# EAGLE design clock (EAGLE 5.11)
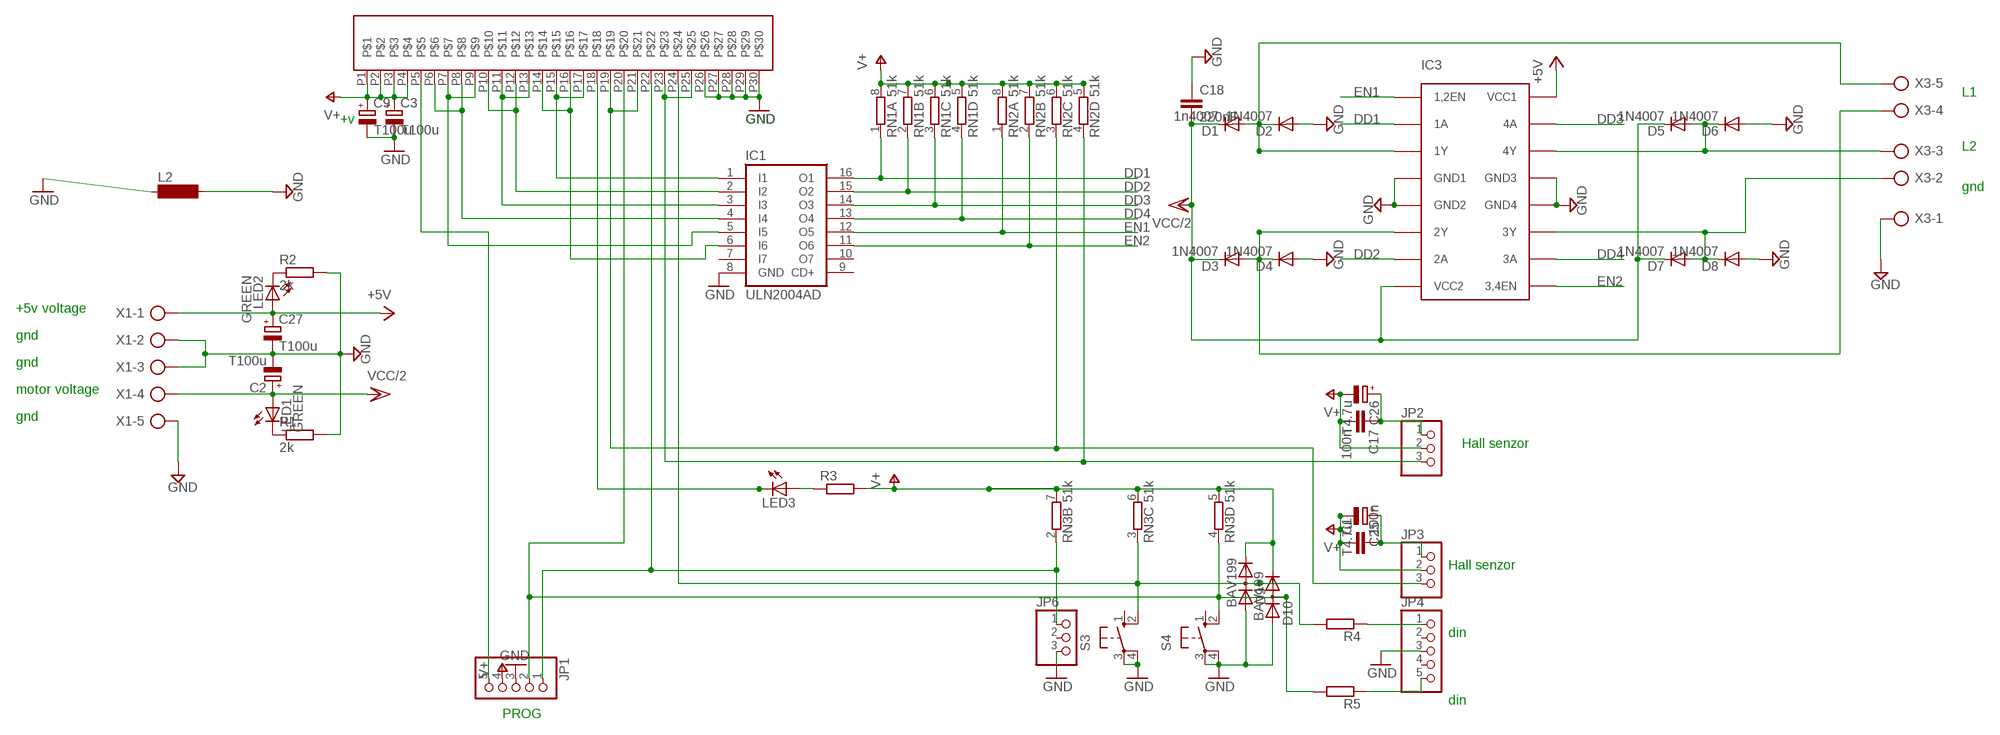
[diagram p0: schematic, sheet 1]

## Parts
C1  100n  C-EUC0603  [C0603]
C2  T100u  CPOL-EUE7.5-18  [E7,5-18]
C3  T100u  CPOL-EUSMCC  [SMC_C]
C9  T100u  CPOL-EUSMCC  [SMC_C]
C17  100n  C-EUC0603  [C0603]
C18  220nF  C-EUC0603  [C0603]
C25  T4.7u  CPOL-EUSMCA  [SMC_A]
C26  T4.7u  CPOL-EUSMCA  [SMC_A]
C27  T100u  CPOL-EUSMCD  [SMC_D]
D1  1n4007  DIODE-DO214AA  [DO214AA]
D2  1N4007  DIODE-DO214AA  [DO214AA]
D3  1N4007  DIODE-DO214AA  [DO214AA]
D4  1N4007  DIODE-DO214AA  [DO214AA]
D5  1N4007  DIODE-DO214AA  [DO214AA]
D6  1N4007  DIODE-DO214AA  [DO214AA]
D7  1N4007  DIODE-DO214AA  [DO214AA]
D8  1N4007  DIODE-DO214AA  [DO214AA]
D9  BAV199  [SOT23]
D10  BAV199  [SOT23]
IC1  ULN2004AD  [SO16]
IC3  L293D  [DIL16]
JP1  PINHD-1X5  [1X05]
JP2  PINHD-1X3  [1X03]
JP3  PINHD-1X3  [1X03]
JP4  PINHD-1X5  [1X05]
JP6  PINHD-1X3  [1X03]
L2  MS85  [MS85]
LED1  GREEN  LEDSMT1206  [1206]
LED2  GREEN  LEDSMT1206  [1206]
LED3  LEDSMT1206  [1206]
R1  2k  R-EU_M0805  [M0805]
R2  2k  R-EU_M0805  [M0805]
R3  R-EU_M0805  [M0805]
R4  R-EU_M0805  [M0805]
R5  R-EU_M0805  [M0805]
RN1  51k  4R-N0603-ARC  [0603-ARC]
RN2  51k  4R-N0603-ARC  [0603-ARC]
RN3  51k  4R-N0603-ARC  [0603-ARC]
S3  40-XX  [B3F-40XX]
S4  40-XX  [B3F-40XX]
U$2  BR5-01132-30XF  FCN-BR-30ZASTRCKA  [FCN-BR5-30]
X1  AK500/5  [AK500/5]
X3  AK500/5  [AK500/5]

## Nets
+5V: C27.+ IC3.16(VCC1) LED2.A X1.1
DD1: IC1.16(O1) IC3.2(1A) RN1.1
DD2: IC1.15(O2) IC3.7(2A) RN1.2
DD3: IC1.14(O3) IC3.15(4A) RN1.3
DD4: IC1.13(O4) IC3.10(3A) RN1.4
DD5: D10.3(AC) JP1.2 R5.2 RN3.4 S4.2(S1) U$2.P20
DD6: D9.3(AC) R4.2 RN3.3 S3.2(S1) U$2.P24
DD7: JP3.3 RN2.3 U$2.P19 U$2.P21
EN1: IC1.12(O5) IC3.1(1,2EN) RN2.1
EN2: IC1.11(O6) IC3.9(3,4EN) RN2.2
GND: C3.- C9.- D9.1(A) D10.1(A) IC1.8(GND) JP1.3 JP4.3 JP6.3 L2.1 S3.3(P) S3.4(P1) S4.3(P) S4.4(P1) U$2.P26 U$2.P27 U$2.P28 U$2.P29 U$2.P30
GND2: C2.- C18.1 C27.- D2.A D4.A D6.A D8.A IC3.4(GND1) IC3.5(GND2) IC3.12(GND4) IC3.13(GND3) L2.2 R1.2 R2.2 X1.2 X1.3 X1.5 X3.1 ; supply symbol labelled GND
GSM_POWERMON: IC1.1(I1) U$2.P15 U$2.P17
GSM_RTS: IC1.2(I2) U$2.P10 U$2.P12
GSM_RX: IC1.3(I3) U$2.P11 U$2.P13
GSM_TX: IC1.4(I4) U$2.P6 U$2.P8
N$1: IC1.6(I6) U$2.P14 U$2.P16
N$2: LED3.A R3.1
N$3: JP1.5 U$2.P5
N$4: JP4.5 R5.1
N$5: D1.A D2.C IC3.3(1Y) X3.5
N$7: IC1.5(I5) U$2.P7 U$2.P9
N$8: D3.A D4.C IC3.6(2Y) X3.4
N$9: D5.A D6.C IC3.14(4Y) X3.3
N$10: D7.A D8.C IC3.11(3Y) X3.2
N$11: JP1.1 JP6.1 RN3.2 U$2.P22
N$12: LED3.C U$2.P18
N$13: JP2.3 RN2.4 U$2.P23 U$2.P25
N$14: LED1.C R1.1
N$15: LED2.C R2.1
N$16: C17.1 C26.+ JP2.1
N$18: JP4.1 R4.1
N$20: C1.2 C25.+ JP3.1
V+: C1.1 C3.+ C9.+ C17.2 C25.- C26.- D9.2(C) D10.2(C) JP1.4 JP2.2 JP3.2 R3.2 RN1.5 RN1.6 RN1.7 RN1.8 RN2.5 RN2.6 RN2.7 RN2.8 RN3.5 RN3.6 RN3.7 U$2.P1 U$2.P2 U$2.P3 U$2.P4
VCC/2: C2.+ C18.2 D1.C D3.C D5.C D7.C IC3.8(VCC2) LED1.A X1.4
Unconnected: IC1.7(I7) IC1.9(CD+) IC1.10(O7) JP4.2 JP4.4 JP6.2 RN3.1 RN3.8 S3.1(S) S4.1(S)

## Notes on the sheet
- L1
- +v | GND
- L2
- gnd
- +5v voltage
- gnd
- gnd
- motor voltage
- gnd
- Hall senzor
- Hall senzor
- din
- din
- PROG

## Library data of the parts
C1 C17 C18 = rcl:C-EU: CAPACITOR, European symbol
C2 C3 C9 C25-C27 = rcl:CPOL-EU: POLARIZED CAPACITOR, European symbol
D1-D8 = diode:DIODE-: DIODE
D9 D10 = diode:BAV199: DIODE low-leakage double diode
IC1 = uln-udn:ULN2004A: DRIVER ARRAY
IC3 = sgs-thom:L293D
JP1 JP4 = pinhead:PINHD-1X5: PIN HEADER
JP2 JP3 JP6 = pinhead:PINHD-1X3: PIN HEADER
L2 = inductor-neosid:MS85: INDUCTOR SMD power inductor; OC_FARNELL: unknown; OC_NEWARK: unknown
LED1-LED3 = led:LED: LED OSRAM: - CHIPLED LG R971, LG N971, LY N971, LG Q971, LY Q971, LO R971, LY R971 LH N974, LH R974 LS Q976, LO Q976, LY Q976 LO Q996 - Hyper CHIPLED LW Q18S LB Q993, LB Q99A, LB R99A - SideLED LS A670, LO A670, LY A670, LG A670, LP A670 LB A673, LV A673, LT A673, LW A673 LH A674 LY A675 LS A676, LA A676, LO A676, LY A676, LW A676 LS A679, LY A679, LG A679 - Hyper Micro SIDELED® LS Y876, LA Y876, LO Y876, LY Y876 LT Y87S - SmartLED LW L88C, LW L88S LB L89C, LB L89S, LG L890 LS L89K, LO L89K, LY L89K LS L896, LA L896, LO L896, LY L896 - TOPLED LS T670, LO T670, LY T670, LG T670, LP T670 LSG T670, LSP T670, LSY T670, LOP T670, LYG T670 LG T671, LOG T671, LSG T671 LB T673, LV T673, LT T673, LW T673 LH T674 LS T676, LA T676, LO T676, LY T676, LB T676, LH T676, LSB T676, LW T676 LB T67C, LV T67C, LT T67C, LS T67K, LO T67K, LY T67K, LW E67C LS E67B, LA E67B, LO E67B, LY E67B, LB E67C, LV E67C, LT E67C LW T67C LS T679, LY T679, LG T679 LS T770, LO T770, LY T770, LG T770, LP T770 LB T773, LV T773, LT T773, LW T773 LH T774 LS E675, LA E675, LY E675, LS T675 LS T776, LA T776, LO T776, LY T776, LB T776 LHGB T686 LT T68C, LB T68C - Hyper Mini TOPLED® LB M676 - Mini TOPLED Santana® LG M470 LS M47K, LO M47K, LY M47K Source: http://www.osram.convergy.de LUXEON: - LUMILED® LXK2-PW12-R00, LXK2-PW12-S00, LXK2-PW14-U00, LXK2-PW14-V00 LXK2-PM12-R00, LXK2-PM12-S00, LXK2-PM14-U00 LXK2-PE12-Q00, LXK2-PE12-R00, LXK2-PE12-S00, LXK2-PE14-T00, LXK2-PE14-U00 LXK2-PB12-K00, LXK2-PB12-L00, LXK2-PB12-M00, LXK2-PB14-N00, LXK2-PB14-P00, LXK2-PB14-Q00 LXK2-PR12-L00, LXK2-PR12-M00, LXK2-PR14-Q00, LXK2-PR14-R00 LXK2-PD12-Q00, LXK2-PD12-R00, LXK2-PD12-S00 LXK2-PH12-R00, LXK2-PH12-S00 LXK2-PL12-P00, LXK2-PL12-Q00, LXK2-PL12-R00 Source: www.luxeon.com KINGBRIGHT: KA-3528ASYC Source: www.kingbright.com
R1-R5 = rcl:R-EU_: RESISTOR, European symbol
RN1-RN3 = resistor-dil:4R-N: Array Chip Resistor Source: RS Component / Phycomp; OC_FARNELL: unknown; OC_NEWARK: unknown
S3 S4 = switch-omron:40-XX: OMRON SWITCH; MF: OMRON COMPONENTS USA; MPN: B3F-4000; OC_FARNELL: 176434; OC_NEWARK: 36K3105
U$2 = MYLIB:FCN-BR-30
X1 X3 = con-ptr500:AK500/5: CONNECTOR; OC_FARNELL: unknown; OC_NEWARK: unknown

## Net classes
0 default: clearance 0.22 mm

## Board
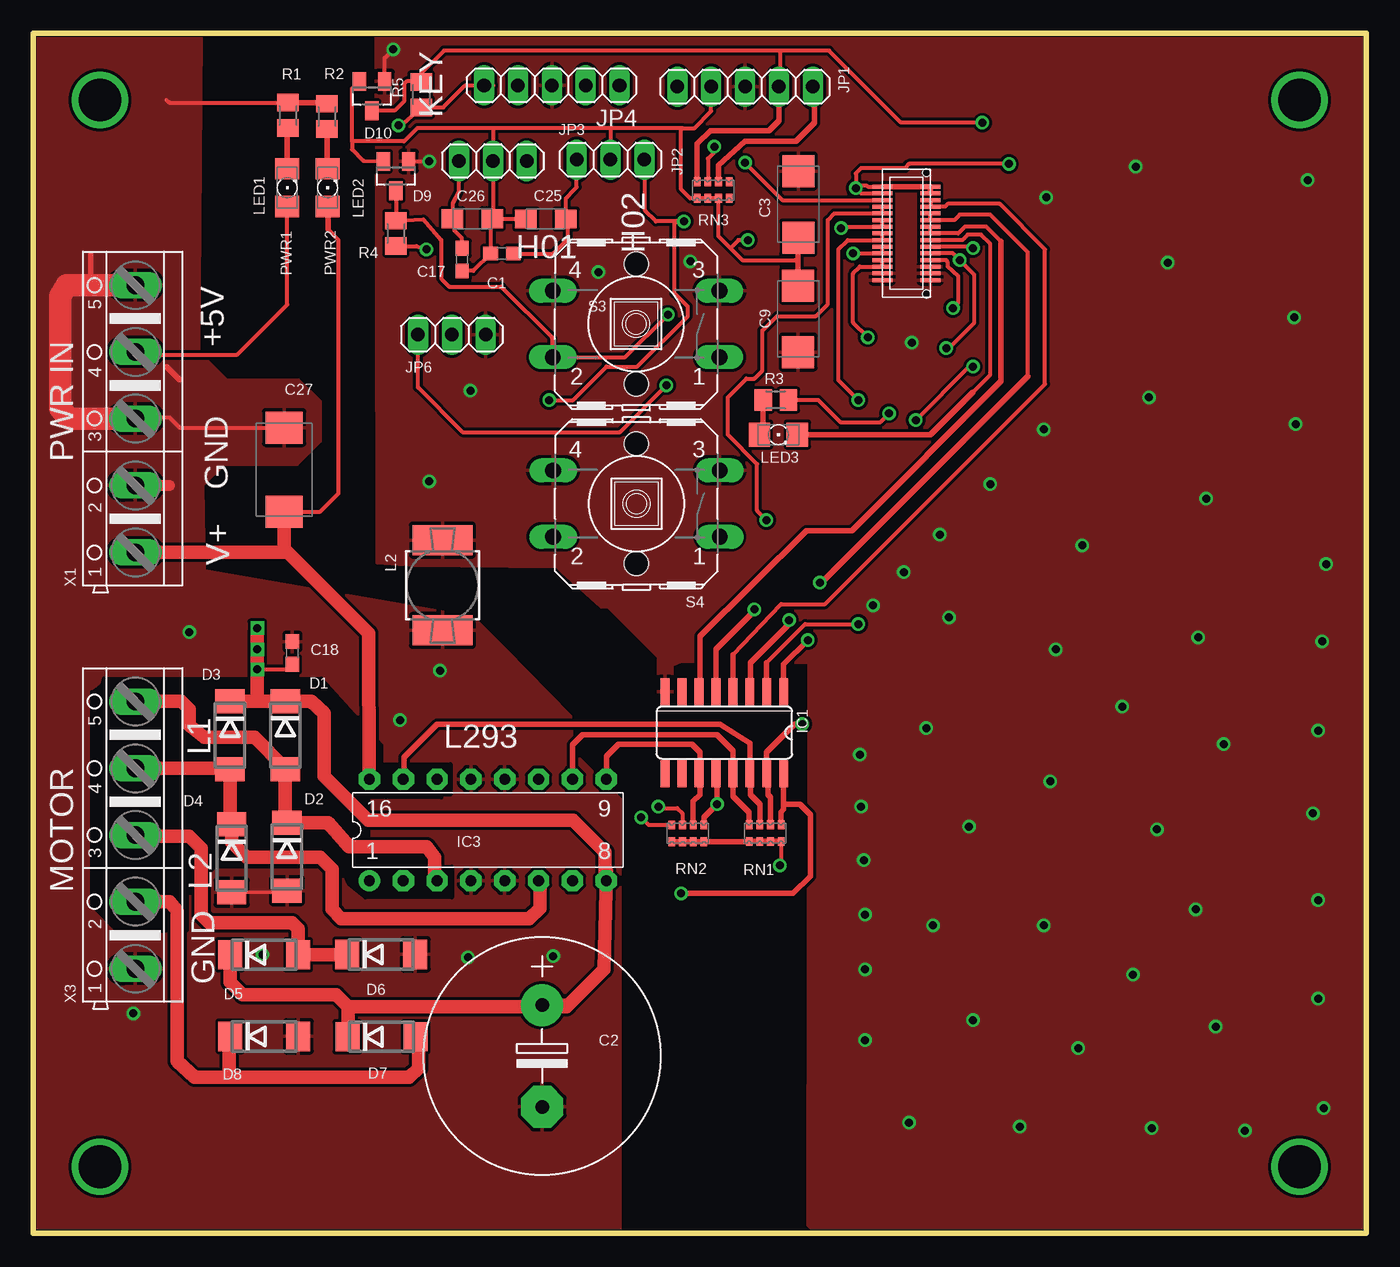
[diagram p1: board, top side]
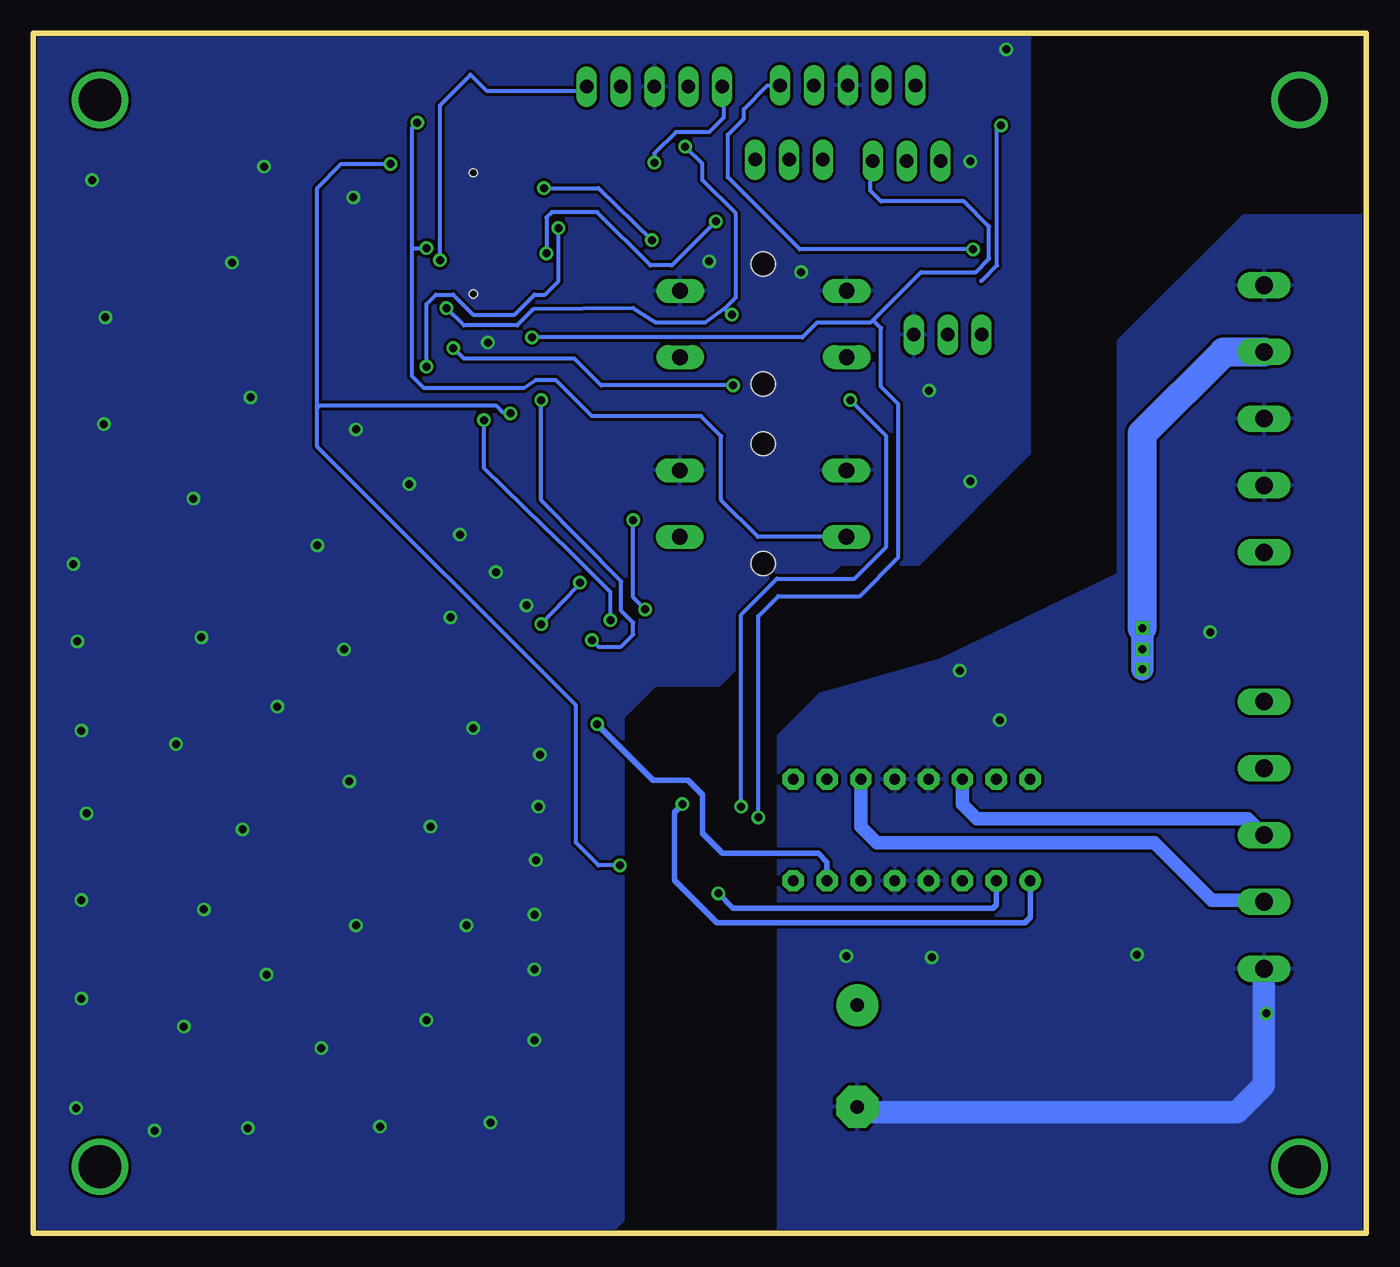
[diagram p2: board, bottom side, seen from below]

Size 100 x 90 mm. Coordinates in mm from the lower left corner, seen from the top.
Outline: 0,90 100,90 100,0 0,0 0,90
Copper layers (1*16): Top 0.018mm / dielectric 1.5mm / Bottom 0.018mm
Design rules "default": minimum track width 6mil, minimum drill 6mil, track to track 5mil, track to pad 5mil, pad to pad 5mil, via to via 5mil, smd to smd 5mil, copper to edge 2mil, drill to drill 8mil, minimum pad ring 10mil, minimum via ring 8mil, stop-mask expansion 4mil, vias tented up to drill 25mil, thermal gap 10mil
tRestrict: area 4.4,22.6 to 31.4,41.6

### Footprints (pad centres in the part's own frame; a part is rotated, then mirrored left to right if it is on the bottom)
C0603 = smd 1.1 x 1: 1 -0.85,0; 2 0.85,0
E7,5-18 = drill 1.016 pad 3.15 round: + -3.81,0 | drill 1.016 pad 3.15 octagon: - 3.81,0
SMC_C = smd 2.4 x 2.4: + -2.5,0; - 2.5,0
SMC_A = smd 1.6 x 1.4: + -1.5,0; - 1.5,0
SMC_D = smd 2.4 x 2.8: + -3.15,0; - 3.15,0
DO214AA = smd 1.8 x 2.2: A 2.55,0; C -2.55,0
SOT23 = smd 1 x 1.4: 1 -0.95,-1.1; 2 0.95,-1.1; 3 0,1.1
SO16 = smd 0.66 x 2.032: 1 -4.445,-3.073; 2 -3.175,-3.073; 3 -1.905,-3.073; 4 -0.635,-3.073; 5 0.635,-3.073; 6 1.905,-3.073; 7 3.175,-3.073; 8 4.445,-3.073; 9 4.445,3.073; 10 3.175,3.073; 11 1.905,3.073; 12 0.635,3.073; 13 -0.635,3.073; 14 -1.905,3.073; 15 -3.175,3.073; 16 -4.445,3.073
DIL16 = drill 0.813 pad 1.6 round: 1 -8.89,-3.81 | drill 0.813 pad 1.6 octagon: 2 -6.35,-3.81; 3 -3.81,-3.81; 4 -1.27,-3.81; 5 1.27,-3.81; 6 3.81,-3.81; 7 6.35,-3.81; 8 8.89,-3.81; 9 8.89,3.81; 10 6.35,3.81; 11 3.81,3.81; 12 1.27,3.81; 13 -1.27,3.81; 14 -3.81,3.81; 15 -6.35,3.81; 16 -8.89,3.81
1X05 = drill 1.016 long: 1 -5.08,0; 2 -2.54,0; 3 0,0; 4 2.54,0; 5 5.08,0
1X03 = drill 1.016 long: 1 -2.54,0; 2 0,0; 3 2.54,0
MS85 = smd 4.5 x 2.25: 1 0,-3.383; 2 0,3.383
1206 = smd 1.6 x 1.803: A -1.422,0; C 1.422,0
M0805 = smd 1.3 x 1.6: 1 -0.95,0; 2 0.95,0
0603-ARC = smd 0.5 x 0.65: 1 -1.2,-0.625; 2 -0.4,-0.625; 3 0.4,-0.625; 4 1.2,-0.625; 5 1.2,0.625; 6 0.4,0.625; 7 -0.4,0.625; 8 -1.2,0.625
B3F-40XX = drill 1.194 long: 1 -6.248,2.489; 2 6.248,2.489; 3 -6.248,-2.489; 4 6.248,-2.489 | hole 1.803: 0,-4.496; 0,4.496
FCN-BR5-30 = smd 0.3 x 1.5: P1 -3.5,-1.8; P2 -3.5,1.8; P3 -3,-1.8; P4 -3,1.8; P5 -2.5,-1.8; P6 -2.5,1.8; P7 -2,-1.8; P8 -2,1.8; P9 -1.5,-1.8; P10 -1.5,1.8; P11 -1,-1.8; P12 -1,1.8; P13 -0.5,-1.8; P14 -0.5,1.8; P15 0,-1.8; P16 0,1.8; P17 0.5,-1.8; P18 0.5,1.8; P19 1,-1.8; P20 1,1.8; P21 1.5,-1.8; P22 1.5,1.8; P23 2,-1.8; P24 2,1.8; P25 2.5,-1.8; P26 2.5,1.8; P27 3,-1.8; P28 3,1.8; P29 3.5,-1.8; P30 3.5,1.8 | hole 0.6: -4.55,1.5; 4.55,1.5
AK500/5 = drill 1.321 long: 1 -10.033,0; 2 -5.004,0; 3 0,0; 4 5.004,0; 5 10.008,0

### Placement (x,y rotation side)
C1  35.16,73.49 0 top
C2  38.17,13.3 270 top
C3  57.39,77.17 90 top
C9  57.38,68.59 270 top
C17  32.17,73.03 270 top
C18  19.44,43.53 270 top
C25  38.46,76.08 180 top
C26  32.94,76.1 0 top
C27  18.82,57.27 90 top
D1  18.9,37.38 270 top
D2  19.02,28.25 270 top
D3  14.75,37.35 270 top
D4  14.88,28.12 270 top
D5  17.3,20.9 0 top
D6  26.1,20.93 0 top
D7  26.12,14.75 0 top
D8  17.32,14.78 0 top
D9  27.2,79.3 180 top
D10  25.4,85.3 180 top
IC1  51.85,37.55 180 top
IC3  34.1,30.25 0 top
JP1  53.4,86 180 top
JP2  34.48,80.42 0 top
JP3  43.3,80.53 0 top
JP4  38.9,86.1 180 top
JP6  31.4,67.4 0 top
L2  30.7,48.6 180 top
LED1  19.05,78.42 90 top
LED2  22.07,78.42 90 top
LED3  55.9,59.9 0 top
R1  19.1,83.85 90 top
R2  22.02,83.78 90 top
R3  55.7,62.5 0 top
R4  27.2,75 90 top
R5  29.1,85.4 90 top
RN1  54.9,30.02 180 top
RN2  49.1,30 180 top
RN3  51,78.25 180 top
S3  45.23,68.2 180 top
S4  45.25,54.73 180 top
U$2  65.5,75 270 top
X1  7.65,61.1 90 top
X3  7.65,29.88 90 top

### Tracks (layer width: path | path; a pad name or v marks a point on that pad's centre or on a via)
+5V
  Top 0.3: C27.+ 21.52,54.12 22.9,55.5 22.9,74.5 22.1,75.3
  Top 0.406: 22.1,75.3 22.1,76.98 LED2.A
  Top 1.016: IC3.16 25.16,45 19.09,51.07 18.8,51.07 | 18.8,51.07 X1.1 | C27.+ 18.81,51.08 18.8,51.07
DD1  (via drill 0.6)
  Top 0.406: v48.6,25.5 57,25.5 58.3,26.8 58.3,31.4 57.5,32.2 56.4,32.2 56.3,32.3 | 56.3,32.3 56.3,31.8 56.1,31.6 RN1.1 | 56.3,32.3 IC1.16
  Bottom 0.406: IC3.2 27.75,24.65 28,24.4 47.5,24.4 v48.6,25.5
DD2  (via drill 0.6)
  Top 0.406: RN1.2 55.3,32.7 55.1,32.9 55.1,34.4 IC1.15 55,34.5 55,36.1 57.1,38.2 v57.7,38.2
  Bottom 0.406: IC3.7 40.45,27.85 41.1,28.5 48.3,28.5 49.8,30 49.8,32.9 50.9,34 53.5,34 v57.7,38.2
DD3
  Top 0.406: RN1.3 54.5,32.2 53.8,32.9 53.8,34.43 IC1.14 53.76,36.74 51.5,38.2 30.3,38.2 27.8,35.7 27.8,34.11 IC3.15
DD4
  Top 0.406: RN1.4 53.7,31.6 52.5,32.8 52.5,34.46 IC1.13 52.5,34.49 52.5,36.2 51.3,37.4 41.2,37.4 40.45,36.65 IC3.10
DD5  (via drill 0.6)
  Top 0.305: D10.3 27.1,84.2 27.8,84.9 27.8,86.2 28,86.4 29.05,86.4 R5.2 29.1,87 30.8,88.7 56,88.7 | JP1.2 56,86.06 56,88.7 | v71.2,83.3 65.1,83.3 59.7,88.7 56,88.7 | U$2.P20 70.4,74 v70.5,73.9
  Top 0.406: JP1.2 55.94,83.44 55.2,82.7 50.8,82.7 49.8,81.7 RN3.4
  Bottom 0.305: S4.2 45.64,52.24 48.4,55 48.4,59.8 49.9,61.3 58.1,61.3 60.8,64 62.3,64 63.2,63.4 70.7,63.4 71.6,64.3 71.6,73.8 | 71.6,73.8 71.6,82.9 v71.2,83.3 | v70.5,73.9 71.5,73.9 71.6,73.8
DD6  (via drill 0.6)
  Top 0.3: 68.5,73 68.6,72.8 68.6,72.5 69.4,71.8
  Top 0.305: 68.5,73 U$2.P24 | 69.4,71.8 69.4,69.8 v69,69.4 | v51.1,81.5 51.1,81.1 50.6,80.6 RN3.3 | D9.3 R4.2 29.25,76.05 30.6,74.5 30.6,71.6 31.2,71 35.1,71 38.9,67.2 38.9,65.79 S3.2 44.41,65.71 v47.6,68.9
  Bottom 0.3: 47.3,70.2 47.3,76.5 49.8,79 49.8,80.2 v51.1,81.5
  Bottom 0.305: v69,69.4 67.7,68.1 63.7,68.1 62.5,69.3 55,69.4 53.3,68.3 49.6,68.3 48.15,69.35 | 48.15,69.35 47.3,70.2 | v47.6,68.9 47.7,68.9 48.15,69.35
DD7  (via drill 0.6)
  Top 0.3: v61.5,73.5 U$2.P21
  Top 0.305: U$2.P21 U$2.P19 | 48.3,75.9 46.7,75.9 45.9,76.7 45.9,79.59 JP3.3 | 48.3,75.9 v48.8,75.9 | RN2.3 48.7,31.5 48.3,31.9 47,31.9 v46.9,32 | v38.7,62.5 40.5,62.5 43,65 45.3,65 49.1,68.8 49.1,69.5 48.1,70.5 48.1,75.7 48.3,75.9
  Bottom 0.305: v61.5,73.5 61.5,76.2 61.1,76.6 57.7,76.6 53.7,72.6 52.1,72.6 v48.8,75.9 | v46.9,32 46.9,46.4 44.2,49.1 38.4,49.1 36,51.5 36,59.8 v38.7,62.5
EN1  (via drill 0.6)
  Top 0.406: IC1.12 51.3,34.39 v51.3,32.2 50.3,31.2 RN2.1
  Bottom 0.406: IC3.1 25.21,23.69 25.6,23.3 48.7,23.3 51.9,26.5 51.9,31.6 v51.3,32.2
EN2
  Top 0.406: IC3.9 42.99,35.79 43.9,36.7 49.4,36.7 50,36.1 50,34.53 IC1.11 50,34.42 50,32.9 49.5,32.4 RN2.2
GND  (via drill 0.6)
  Top 0.305: 28.15,80.35 D9.1 v29.7,80.4 | D10.1 26.35,88.15 v27,88.8
  Bottom 0.305: v29.7,80.4 29.9,80.4 | v27,88.8 27,88.4
  other vias: 49.3,72.9 65.9,66.8 42.4,72.1 62,35.9 62.1,32 62.3,28 62.4,23.9 62.4,19.8 62.4,14.5 75.8,23.1 96.8,9.4 96.4,17.6 96.4,25 96,31.5 96.4,37.7 65.7,8.3 74,8 83.9,7.9 90.9,7.7 82.5,19.4 70.5,16 84.3,30.3 70.2,30.5 88.7,15.5 78.4,13.9 87.2,24.3 67.5,23.1 89.3,36.7 76.3,33.9 67,37.9 75.8,60.3 68,52.4 63,47.1 71.8,56.2 65.3,49.6 76,77.7 97,50.2 96.7,44.4 87.4,44.7 76.7,43.8 78.7,51.6 68.7,46.2 81.7,39.5 88,55.1 94.7,60.7 83.7,62.7 94.6,68.7 85.1,72.8 95.6,79 82.7,80 32.8,63.2 29.7,56.4
  pour Top: 25.7,95.6 25.8,50.3 28.4,50.1 39.3,50 39.7,49.6 42.6,47 43.1,47 46.9,43.2 46.9,40.1 47.2,40.1 47.9,40.2 47.9,42.6 48.6,42.9 58.2,42.8 58.1,0.6 61.9,-3.2 100.1,-3.2 103.4,0.1 103.4,96.2 100.9,98.7 31.2,98.7
  pour Bottom: 25.3,95.6 25.3,58.5 33.6,50.2 39.5,50.2 48.6,41.1 53.4,41.1 55.8,38.7 55.8,1 61.9,-5.1 100.4,-5.1 105.4,-0.1 105.4,98.1 101.8,101.7 31.4,101.7 25.4,96.4
GND2  (via drill 0.6)
  Top 0.254: 14.8,25.5 D4.A 19.32,25.57 19.5,25.4 19.32,25.4 D2.A
  Top 0.3: R1.2 10.2,84.8 10,85 | C27.- 10.98,60.42 10.2,61.2 7.35,61.2 X1.3
  Top 0.406: R1.2 21.95,84.8 R2.2 | 4.3,73.4 4.3,71.6 4.8,71.1 | 10,65 10.98,64.02
  Top 0.813: 10.2,56.1 7.25,56.1 X1.2
  Top 1.676: 7.25,61.1 X1.3 2.7,61.1 2,61.9 2,70.3 2.5,71.1 4.8,71.1 7.24,71.1 X1.5
  Bottom 1.676: 38.1,9.3 38.2,9.3 38,9.1 9.7,9.1 7.7,11.1 7.7,19.8 X3.1
  other vias: 32.6,20.7 7.5,16.5 39,20.8 17.2,20.9 11.7,45.1 27.5,38.5 30.5,42.2
  pour Top: 12.6,89.9 12.4,66.1 14.5,64 19.9,64 21.5,62.4 21.5,59.4 19.8,57.7 14.3,57.7 12.7,56.1 12.8,49.7 33,46.2 35.4,43.8 40.3,38.8 40.5,36.1 44,32.6 44,-2.2 43.3,-2.9 -2.8,-2.9 -3.9,-1.8 -4.1,90.1
  pour Bottom: -3.5,76.3 9.2,76.3 18.6,66.9 18.6,49.4 31.9,43 41,40.4 44.1,37.3 44.1,-4.9 42.1,-6.9 -1.9,-6.9 -7.8,-1 -7.8,71.7 -3.3,76.2
GSM_POWERMON  (via drill 0.6)
  Top 0.3: 61.1,74.5 U$2.P17
  Top 0.305: U$2.P17 U$2.P15 | 61.1,74.5 60.4,73.8 60.4,64 v61.9,62.5
  Top 0.406: IC1.1 56.3,42.7 v58.1,44.5
  Bottom 0.305: v58.1,44.5 57.6,44 55.9,44 55,44.9 55,45.8 55.9,46.7 55.9,48.9 61.9,55 v61.9,62.5
GSM_RTS  (via drill 0.6)
  Top 0.305: U$2.P10 U$2.P12 69.1,76 69.5,76.4 71.8,76.4 74.6,73.6 74.6,64.3 | v59,48.8 59.3,49 | v61.9,45.7 57.9,45.7 55,42.8 | IC1.2 55,40.65
  Top 0.406: 59.3,49 74.6,64.3 | 55,40.65 55,42.8
  Bottom 0.305: v59,48.8 59.2,48.5 v61.9,45.7
GSM_RX  (via drill 0.6)
  Top 0.3: 60.7,75.5 U$2.P13
  Top 0.305: U$2.P13 U$2.P11 | v60.6,75.4 60.7,75.5 | v70.5,65 70.2,65 v66.2,61 | 56.7,45.7 v56.7,46 | IC1.3 53.8,40.67
  Top 0.406: 56.7,45.7 53.8,42.8 53.8,40.67
  Bottom 0.305: v60.6,75.4 60.6,71.4 61.6,70.4 62.4,70.4 63.9,68.9 67,68.9 68.5,70.4 69.8,70.4 70.5,69.7 v70.5,65 | v66.2,61 66.2,57.4 61.7,53 60,51.4 56.7,48.1 v56.7,46
GSM_TX
  Top 0.254: 67.33,77.05 67.3,77.05
  Top 0.3: 67.33,77.05 67.3,77.02 U$2.P8
  Top 0.305: 52.48,43.38 56.1,47.2 59.4,47.2 75.9,63.7 75.9,73.8 72.5,77.2 68.6,77.2 68.4,77 U$2.P8 | 67.33,77.05 67.33,77.47 U$2.P6
  Top 0.406: IC1.4 52.48,43.38
N$1
  Top 0.305: U$2.P14 U$2.P16 69.4,75 69.9,75.5 71.5,75.5 72.6,74.4 | IC1.6 50,41.07
  Top 0.406: 72.6,74.4 72.6,63.9 61.4,52.7 58,52.7 50,44.8 50,41.07
N$2
  Top 0.406: R3.1 54.75,60.17 LED3.A
N$3  (via drill 0.6)
  Top 0.305: U$2.P5 56.2,77.5 v53.4,80.3
  Bottom 0.305: v53.4,80.3 53.4,81 51.8,82.6 49.3,82.6 48.2,83.7 48.2,85.88 JP1.5
N$4  (via drill 0.6)
  Top 0.3: R5.1 30.75,84.45 32.4,86.1 JP4.5 34.5,86.1
  Top 0.305: v27.4,83.1 27.95,83.4 R5.1
  Bottom 0.305: 28.89,71.41 27.7,72.6 27.7,83 v27.4,83.1
N$5
  Top 1.016: X3.5 7.67,39.9 11.1,39.9 11.7,39.3 11.7,38.1 12.8,37.2 16.6,37.2 18.9,34.9 D1.A 18.9,30.93 D2.C 22.1,30.8 23.7,29 29.5,29 30.1,28.2 30.1,26.63 IC3.3
N$7  (via drill 0.6)
  Top 0.254: U$2.P7 63.7,76.9
  Top 0.305: U$2.P7 U$2.P9 60.1,76.5 59.6,76 59.6,69.7 58.7,68.8 55.8,68.8 54.7,67.7 54.7,64.7 54.1,64.1 53.5,64.1 52.1,62.7 52.1,59.9 54.3,57.7 54.3,54.2 v55,53.5 | 54.1,46.7 v54.1,46.8 | IC1.5 51.2,40.64
  Top 0.406: 54.1,46.7 51.2,43.8 51.2,40.64
  Bottom 0.305: v55,53.5 55,47.7 v54.1,46.8
N$8
  Top 1.016: X3.4 11.82,34.88 12.7,34.9 14.65,34.9 D3.A 14.75,30.8 D4.C 14.88,29.32 16,28.2 21.5,28.2 22.4,27.3 22.4,24.3 23.1,23.6 37.2,23.6 38,24.4 38,26.35 IC3.6
N$9
  Top 1.016: D6.C 23.52,20.9 D5.A 19.85,22.85 19.4,23.3 13.2,23.3 12.6,23.9 12.6,28.9 11.7,29.8 7.72,29.8 X3.3
  Bottom 1.016: IC3.14 30.29,32.19 29.2,31.1 8.88,31.1 X3.3
N$10
  Top 1.016: X3.2 10.23,24.87 10.8,24.2 10.8,12.9 12.1,11.7 14.7,11.7 | D8.C 14.7,14.7 14.7,11.7 | 14.7,11.7 28.2,11.7 28.9,12.4 28.9,14.53 D7.A
  Bottom 1.016: IC3.11 37.91,30.51 36.7,29.3 15.9,29.3 11.6,25 7.78,25 X3.2
N$11  (via drill 0.6)
  Top 0.3: U$2.P22 69,73.5 v69.5,73 70.6,71.9 70.6,68.3 68.7,66.4 v68.5,66.4 | JP6.1 28.86,63.44 32.2,60.1 44,60.1 v47.5,63.6
  Top 0.406: RN3.2 51.4,80.1 53.4,81.9 57.2,81.9 58.6,83.3 58.6,85.88 JP1.1
  Bottom 0.3: v47.5,63.6 57.4,63.6 59.4,65.6 67.7,65.6 v68.5,66.4
  Bottom 0.305: v69.5,73 69.5,84.6 67.2,86.9 66,85.7 58.78,85.7 JP1.1
N$12
  Top 0.305: U$2.P18 69.7,74.5 70.1,74.9 71.1,74.9 71.8,74.2 71.8,64.4 70.5,63.1
  Top 0.406: LED3.C 67.3,59.9 70.5,63.1
N$13  (via drill 0.6)
  Top 0.254: U$2.P23 63.7,72.99 63.73,72.99
  Top 0.305: 63.7,72.99 U$2.P25 62,72.5 61.5,72 61.5,68.3 v62.6,67.2 | RN2.4 46.17,30.62 v45.6,31.2
  Bottom 0.305: v62.6,67.2 42.3,67.2 41.2,68.3 37.2,68.3 37,68.5 | 37,68.5 33.4,72.1 29.3,72.1 28.3,73.1 28.3,75.5 30.2,77.4 36.4,77.4 37.2,78.2 37.2,80.7 37.4,80.9 37.4,80.51 JP2.3 | v45.6,31.2 45.6,46.3 44.1,47.8 38,47.8 35.1,50.7 35.1,62.2 36.4,63.5 36.4,67.9 37,68.5
N$14
  Top 0.406: LED1.C 19.05,82.85 R1.1
N$15
  Top 0.406: R2.1 22.02,79.9 LED2.C
N$16
  Top 0.305: JP2.1 31.93,78.13 31.5,77.3 31.5,76.16 C26.+ 31.6,75.94 31.6,75.2 32.17,74.63 C17.1
N$17  (via drill 3.2)
  other vias: 5,5
N$18  (via drill 0.6)
  Top 0.305: R4.1 28.75,74.05 v29.5,73.8
  Bottom 0.3: JP4.1 44.91,86.1 46.7,84.31 46.7,83.6 47.9,82.4 47.9,79.2 46.7,78
  Bottom 0.305: v29.5,73.8 42.5,73.8 46.7,78
N$20
  Top 0.305: JP3.1 40.76,78.46 40.6,78.3 39.96,77.62 C25.+ 40.1,75.94 40.1,74.6 38.99,73.49 C1.2
N$21  (via drill 3.2)
  other vias: 95,5
N$22  (via drill 3.2)
  other vias: 95,85
N$23  (via drill 3.2)
  other vias: 5,85
V+  (via drill 0.6)
  Top 0.254: U$2.P2 67.36,78.5 67.38,78.48 | U$2.P4 67.54,78 67.56,78.02
  Top 0.305: 43.3,82.9 JP3.2 | JP1.4 50.86,84.16 49.6,82.9 48.7,82.9 | 48.7,82.9 43.3,82.9 | D9.2 24.75,80.45 23.9,81.3 23.9,81.9 | 23.9,81.9 23.9,85.85 D10.2 | 52.3,73.9 51.4,74.8 RN3.7 RN3.6 RN3.5 49.27,77.62 48.6,78.3 48.6,82.8 48.7,82.9 | 52.3,73.9 53.2,73 57.18,73 57.38,72.8 | v61.7,78.4 61.9,78.6 62.5,78.6 62.6,78.5 U$2.P1 | v53.6,74.5 52.9,74.5 52.3,73.9 | C26.- 36.94,76.1 C25.- | C26.- 34.48,76.33 JP2.2 34.48,82.88 35,82.9 | C26.- 34.31,75.96 C1.1 33,72.18 C17.2 | 35,82.9 28.8,82.9 27.8,81.9 23.9,81.9 | 43.3,82.9 35,82.9 | U$2.P3 62.1,78 v61.7,78.4 | RN1.8 56.1,27.7 v56,27.6 | v73.2,80.2 65.7,80.2 65.4,79.9 62.1,79.9 61.7,79.5 v61.7,78.4 | R3.2 58.9,62.5 60.6,60.8 63.5,60.8 v64.2,61.5
  Top 0.406: RN2.5 RN2.6 RN2.7 RN2.8 53.67,29.38 RN1.5 RN1.6 RN1.7 RN1.8 | C9.+ 57.38,72.8 57.38,74.66 C3.+ | U$2.P1 U$2.P2 U$2.P4
  Bottom 0.305: v61.7,78.4 57.6,78.4 v53.6,74.5 | v56,27.6 57.6,27.6 59.3,29.3 59.3,39.6 78.7,59 78.7,61.9 | 78.7,61.9 78.7,78.4 76.9,80.2 v73.2,80.2 | v64.2,61.5 64.2,61.6 64.8,61.6 65.3,62.1 78.5,62.1 78.7,61.9
VCC/2  (via drill 0.6)
  Top 0.3: LED1.A 19.05,69.65 15.3,65.9 7.45,65.9 X1.4
  Top 0.305: v16.8,42.3 19.06,42.3 C18.2
  Top 1.016: D5.C 14.75,18.85 15.7,17.9 22.7,17.9 23.6,17 | 23.6,17 23.6,14.78 D7.C | 23.6,17 40,17 40.11,17.11 | D3.C 16.8,39.9 16.8,40.1 | 16.8,40.1 16.8,45.1 v16.8,42.3 | 40.11,17.11 C2.+ | 40.11,17.11 42.8,19.8 43,27.15 IC3.8 42.9,26.53 42.9,28.6 40.5,31 25.1,31 21.8,34.3 21.8,39 20.82,39.92 D1.C 18.88,39.9 17,39.9 16.8,40.1
  Bottom 0.406: v16.8,45.4 v16.8,43.8 | v16.8,45.4
  Bottom 1.016: 10.7,66.1 10.75,66.1
  Bottom 1.676: v16.8,42.3 v16.8,45.4 | 10.7,66.1
  Bottom 2.184: v16.8,45.4 16.8,60 10.7,66.1 | 10.7,66.1 X1.4

### Text on the board
tPlace: L293
tNames: KEY | H02 | PWR1 | PWR2 | H01 | +5V | PWR IN | GND | V+ | L1 | MOTOR | L2 | GND